# Altium schematic sheet ESC.SchDoc
size A
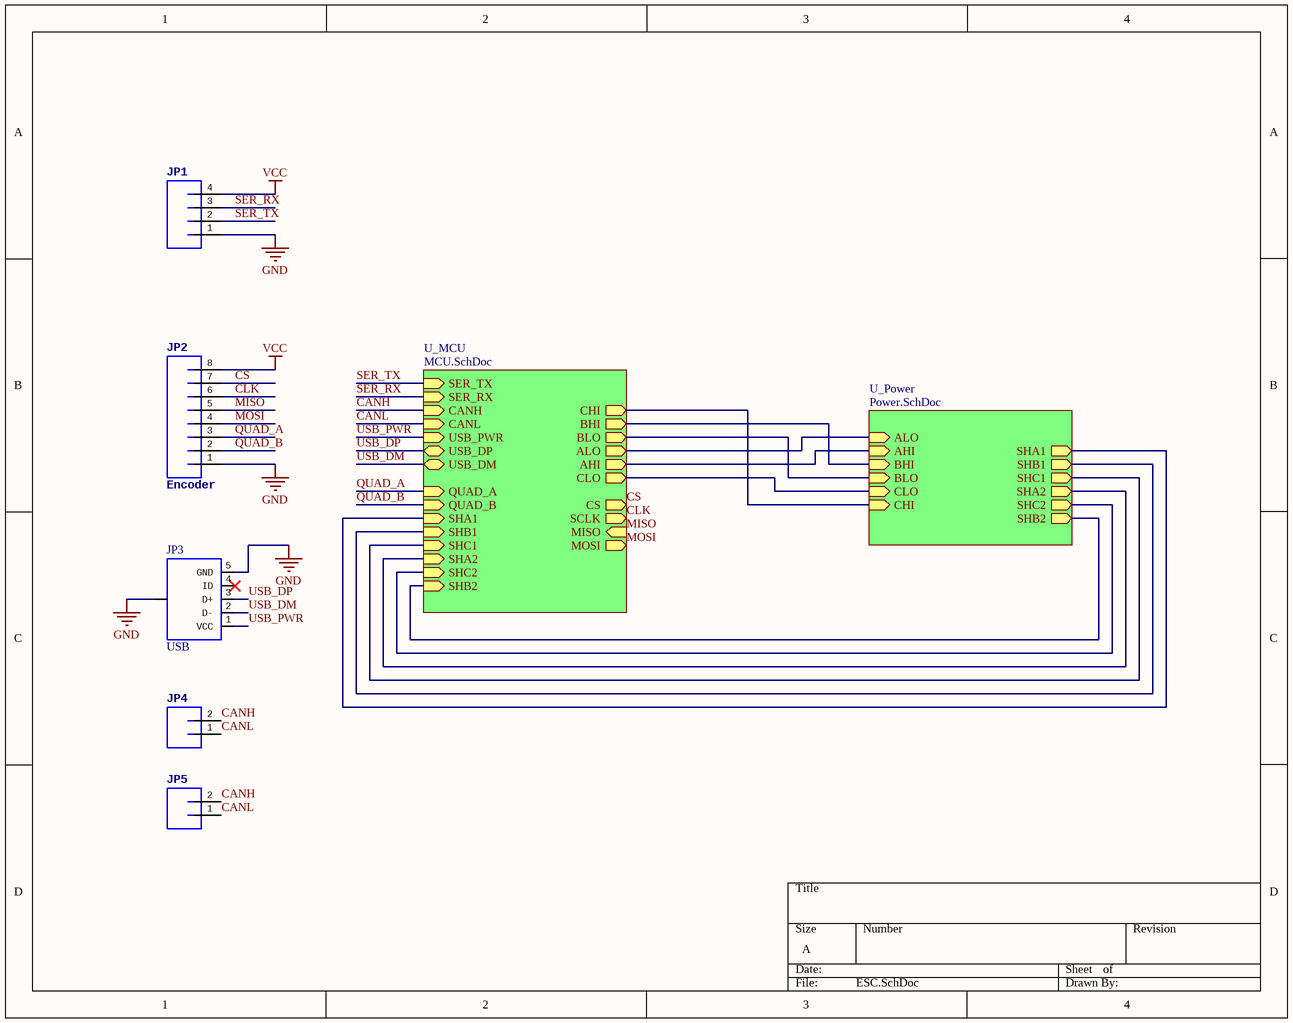
[diagram p0: ESC.SchDoc]

## Parts
JP1  (no value)  [JST-4-PTH-VERT]
JP2  Encoder  [JST-8-PTH-VERT]
JP3  USB  [USB-MICROB]
JP4  (no value)  [JST-2-PTH-VERT]
JP5  (no value)  [JST-2-PTH-VERT]

## Sub-sheets
U_MCU = MCU.SchDoc: CHI (out), BHI (out), BLO (out), ALO (out), AHI (out), CLO (out), MISO (in), SCLK (out), CS (out), QUAD_A (in), QUAD_B (in), SHC1 (in), SHB1 (in), USB_DP (bidir), MOSI (out), USB_DM (bidir), SHA1 (in), USB_PWR (in), CANH (in), CANL (in), SER_TX (in), SER_RX (in), SHA2 (in), SHC2 (in), SHB2 (in)
U_Power = Power.SchDoc: ALO (in), AHI (in), BHI (in), BLO (in), CLO (in), CHI (in), SHB1 (out), SHC1 (out), SHA1 (out), SHA2 (out), SHC2 (out), SHB2 (out)

## Nets
GND: JP1.1 JP2.1 JP3.5(GND) JP3.6(SHIELD)
VCC: JP1.4 JP2.8
CANH: JP4.2 JP5.2 ; sheet U_MCU/CANH
CANL: JP4.1 JP5.1 ; sheet U_MCU/CANL
CLK: JP2.6 ; sheet U_MCU/SCLK
CS: JP2.7 ; sheet U_MCU/CS
MISO: JP2.5 ; sheet U_MCU/MISO
MOSI: JP2.4 ; sheet U_MCU/MOSI
QUAD_A: JP2.3 ; sheet U_MCU/QUAD_A
QUAD_B: JP2.2 ; sheet U_MCU/QUAD_B
SER_RX: JP1.3 ; sheet U_MCU/SER_RX
SER_TX: JP1.2 ; sheet U_MCU/SER_TX
USB_DM: JP3.2(D-) ; sheet U_MCU/USB_DM
USB_DP: JP3.3(D+) ; sheet U_MCU/USB_DP
USB_PWR: JP3.1(VCC) ; sheet U_MCU/USB_PWR
(unnamed): sheet U_MCU/CHI, sheet U_Power/CHI
(unnamed): sheet U_MCU/BHI, sheet U_Power/BHI
(unnamed): sheet U_MCU/BLO, sheet U_Power/BLO
(unnamed): sheet U_MCU/ALO, sheet U_Power/ALO
(unnamed): sheet U_MCU/AHI, sheet U_Power/AHI
(unnamed): sheet U_MCU/CLO, sheet U_Power/CLO
(unnamed): sheet U_MCU/SHC1, sheet U_Power/SHC1
(unnamed): sheet U_MCU/SHB1, sheet U_Power/SHB1
(unnamed): sheet U_MCU/SHA1, sheet U_Power/SHA1
(unnamed): sheet U_MCU/SHA2, sheet U_Power/SHA2
(unnamed): sheet U_MCU/SHC2, sheet U_Power/SHC2
(unnamed): sheet U_MCU/SHB2, sheet U_Power/SHB2

Not connected (* = marked no-connect by the designer): JP3 4(ID)*

## Library data of the parts
JP1 = JST_4_VERT
JP2 = JST_8_VERT
JP3 = USB_MICROB_PLUG-SMT: pin to pad: 1>VBUS 2>D- 3>D+ 4>ID 5>GND 6>MT1+P$1+P$2+MT2; PROD_ID: CONN-09900
JP4 JP5 = JST_2_VERT